# Altium schematic sheet Schematics.SchDoc
size A4
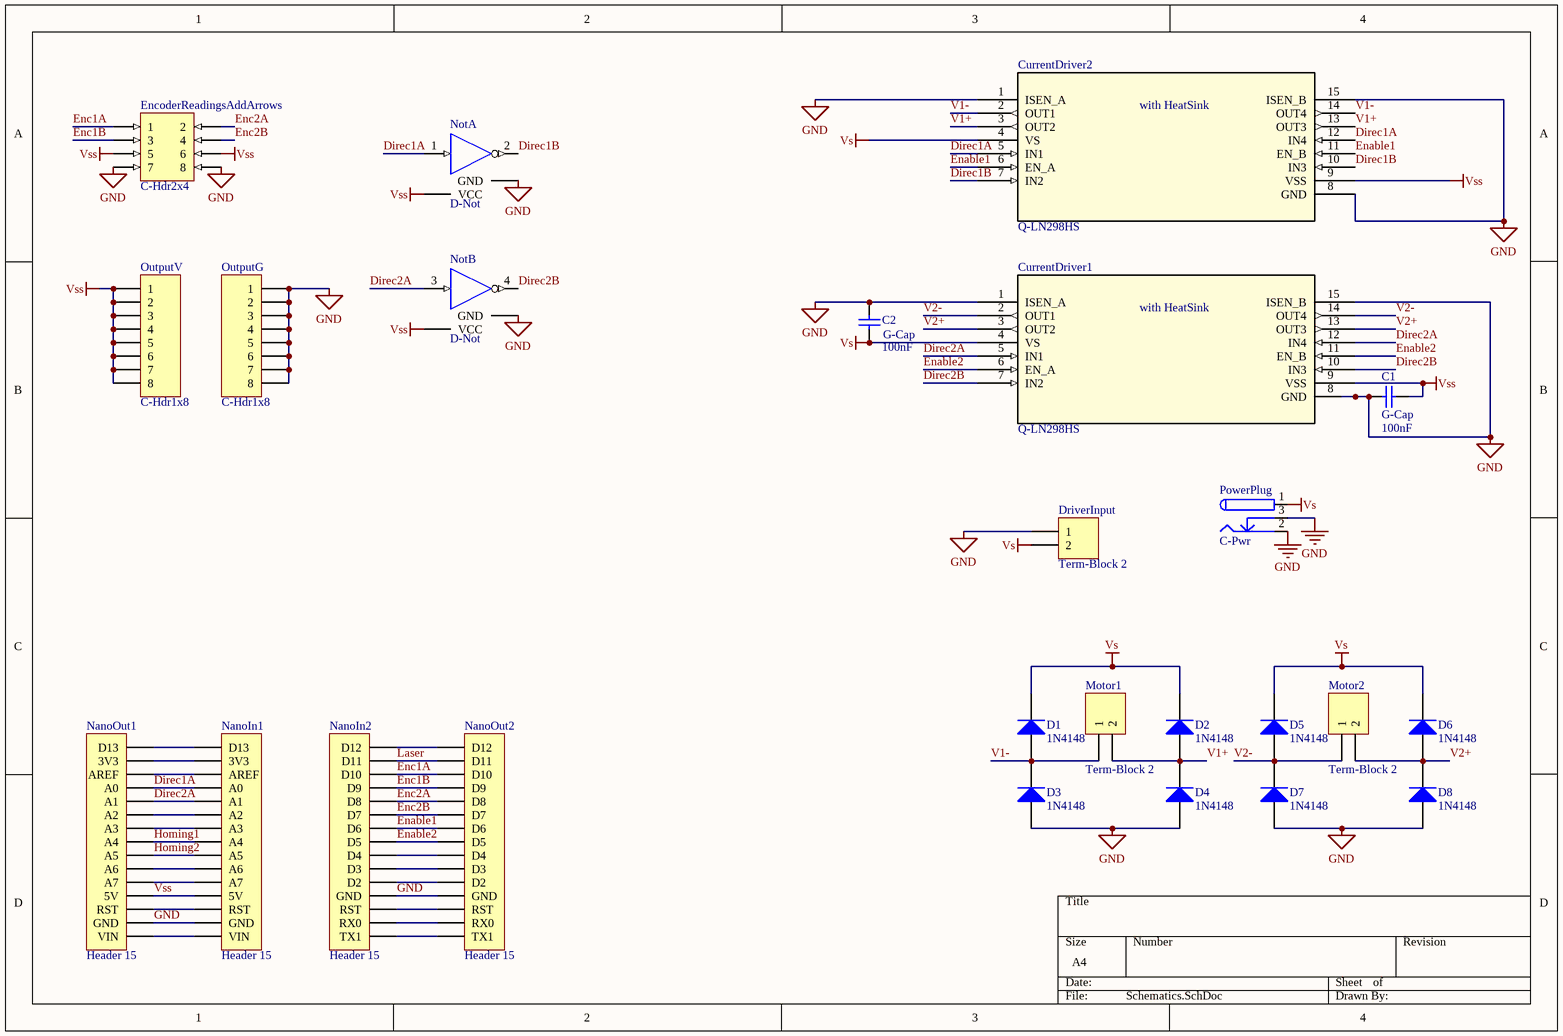
[diagram p0: Schematics.SchDoc]

## Parts
C1  G-Cap  value 100nF  [Cap2.54mm_LGE1.0]
C2  G-Cap  value 100nF  [Cap2.54mm_LGE1.0]
CurrentDriver1  Q-LN298HS  [Multiwatt15_V_ELEC391HS]
CurrentDriver2  Q-LN298HS  [Multiwatt15_V_ELEC391HS]
D1  1N4148  [DO-41_XLGE1.2]
D2  1N4148  [DO-41_XLGE1.2]
D3  1N4148  [DO-41_XLGE1.2]
D4  1N4148  [DO-41_XLGE1.2]
D5  1N4148  [DO-41_XLGE1.2]
D6  1N4148  [DO-41_XLGE1.2]
D7  1N4148  [DO-41_XLGE1.2]
D8  1N4148  [DO-41_XLGE1.2]
DriverInput  Term-Block 2  [TERM-BLOCK-5.08MM-2POS]
EncoderReadingsAddArrows  C-Hdr2x4  [HDR2X4_LGE1.0]
Motor1  Term-Block 2  [TERM-BLOCK-5.08MM-2POS]
Motor2  Term-Block 2  [TERM-BLOCK-5.08MM-2POS]
NanoIn1  Header 15  [HDR1X15]
NanoIn2  Header 15  [HDR1X15]
NanoOut1  Header 15  [HDR1X15]
NanoOut2  Header 15  [HDR1X15]
Not  D-Not  [DIP14_LGE1.0]  (parts A,B of 6)
OutputG  C-Hdr1x8  [HDR1X8_LGE1.0]
OutputV  C-Hdr1x8  [HDR1X8_LGE1.0]
PowerPlug  C-Pwr  [KLD_XLGE1.2]

## Nets
GND: C1.1 C2.2 CurrentDriver1.1(ISEN_A) CurrentDriver1.8(GND) CurrentDriver1.15(ISEN_B) CurrentDriver2.1(ISEN_A) CurrentDriver2.8(GND) CurrentDriver2.15(ISEN_B) D3.1(A) D4.1(A) D7.1(A) D8.1(A) DriverInput.1 EncoderReadingsAddArrows.7 EncoderReadingsAddArrows.8 NanoIn1.14(GND) NanoIn2.12(GND) NanoOut1.14(GND) NanoOut2.12(GND) Not.7(GND) OutputG.1 OutputG.2 OutputG.3 OutputG.4 OutputG.5 OutputG.6 OutputG.7 OutputG.8 PowerPlug.2 PowerPlug.3
Vs: C2.1 CurrentDriver1.4(VS) CurrentDriver2.4(VS) D1.2(K) D2.2(K) D5.2(K) D6.2(K) DriverInput.2 PowerPlug.1
Vss: C1.2 CurrentDriver1.9(VSS) CurrentDriver2.9(VSS) EncoderReadingsAddArrows.5 EncoderReadingsAddArrows.6 NanoIn1.12(5V) NanoOut1.12(5V) Not.14(VCC) OutputV.1 OutputV.2 OutputV.3 OutputV.4 OutputV.5 OutputV.6 OutputV.7 OutputV.8
Direc1A: CurrentDriver2.5(IN1) CurrentDriver2.12(IN4) NanoIn1.4(A0) NanoOut1.4(A0) Not.1(A)
Direc1B: CurrentDriver2.7(IN2) CurrentDriver2.10(IN3) Not.2(Y)
Direc2A: CurrentDriver1.5(IN1) CurrentDriver1.12(IN4) NanoIn1.5(A1) NanoOut1.5(A1) Not.3(A)
Direc2B: CurrentDriver1.7(IN2) CurrentDriver1.10(IN3) Not.4(Y)
Enable1: CurrentDriver2.6(EN_A) CurrentDriver2.11(EN_B) NanoIn2.7(D6) NanoOut2.7(D6)
Enable2: CurrentDriver1.6(EN_A) CurrentDriver1.11(EN_B) NanoIn2.8(D5) NanoOut2.8(D5)
Enc1A: EncoderReadingsAddArrows.1 NanoIn2.3(D10) NanoOut2.3(D10)
Enc1B: EncoderReadingsAddArrows.3 NanoIn2.4(D9) NanoOut2.4(D9)
Enc2A: EncoderReadingsAddArrows.2 NanoIn2.5(D8) NanoOut2.5(D8)
Enc2B: EncoderReadingsAddArrows.4 NanoIn2.6(D7) NanoOut2.6(D7)
Homing1: NanoIn1.8(A4) NanoOut1.8(A4)
Homing2: NanoIn1.9(A5) NanoOut1.9(A5)
Laser: NanoIn2.2(D11) NanoOut2.2(D11)
V1+: CurrentDriver2.3(OUT2) CurrentDriver2.13(OUT3) D2.1(A) D4.2(K) Motor1.2
V1-: CurrentDriver2.2(OUT1) CurrentDriver2.14(OUT4) D1.1(A) D3.2(K) Motor1.1
V2+: CurrentDriver1.3(OUT2) CurrentDriver1.13(OUT3) D6.1(A) D8.2(K) Motor2.2
V2-: CurrentDriver1.2(OUT1) CurrentDriver1.14(OUT4) D5.1(A) D7.2(K) Motor2.1
NetNanoIn1_1: NanoIn1.1(D13) NanoOut1.1(D13)
NetNanoIn1_2: NanoIn1.2(3V3) NanoOut1.2(3V3)
NetNanoIn1_3: NanoIn1.3(AREF) NanoOut1.3(AREF)
NetNanoIn1_6: NanoIn1.6(A2) NanoOut1.6(A2)
NetNanoIn1_7: NanoIn1.7(A3) NanoOut1.7(A3)
NetNanoIn1_10: NanoIn1.10(A6) NanoOut1.10(A6)
NetNanoIn1_11: NanoIn1.11(A7) NanoOut1.11(A7)
NetNanoIn1_13: NanoIn1.13(RST) NanoOut1.13(RST)
NetNanoIn1_15: NanoIn1.15(VIN) NanoOut1.15(VIN)
NetNanoIn2_1: NanoIn2.1(D12) NanoOut2.1(D12)
NetNanoIn2_9: NanoIn2.9(D4) NanoOut2.9(D4)
NetNanoIn2_10: NanoIn2.10(D3) NanoOut2.10(D3)
NetNanoIn2_11: NanoIn2.11(D2) NanoOut2.11(D2)
NetNanoIn2_13: NanoIn2.13(RST) NanoOut2.13(RST)
NetNanoIn2_14: NanoIn2.14(RX0) NanoOut2.14(RX0)
NetNanoIn2_15: NanoIn2.15(TX1) NanoOut2.15(TX1)

## Notes on the sheet
- (in symbol Q-LN298HS) with HeatSink

## Library data of the parts
C1 C2 = G-Cap: Capacitor (specify value); Published: 8-Jun-2000; LatestRevisionDate: 17-Jul-2002; LatestRevisionNote: Re-released for DXP Platform.; PackageReference: RAD-0.3; Publisher: Altium Limited
CurrentDriver1 CurrentDriver2 = Q-LN298HS: LN298 - IC Bridge Driver Par 15Multiwatt; Manufacturer_Part_Number: L298N; Vendor: ST Microelectronics; Input Type: Non-Inverting; Number of Outputs: 4; Current - Output / Channel: 2A; Current - Peak Output: 3A; Voltage - Supply: 4.5 V ~ 46 V; C: Copyright (C) 2015 Accelerated Designs. All rights reserved; Quantity_Available: 5651; DataSheet: http://www.st.com/internet/com/TECHNICAL_RESOURCES/TECHNICAL_LITERATURE/DATASHEET/CD00000240.pdf; Type: Type; On-State Resistance: -; Operating Temperature: -25Â°C ~ 130Â°C; Mounting Type: Through Hole; Package / Case: Multiwatt-15 (Vertical, Bent and Staggered Leads); Supplier Device Package: 15-Multiwatt; Packaging: Tube; Copyright: Copyright (C) 2015 Accelerated Designs. All rights reserved; RefDes: RefDes; Value: Value; ComponentLink1URL: http://www.st.com/content/ccc/resource/technical/document/datasheet/82/cc/3f/39/0a/29/4d/f0/CD00000240.pdf/files/CD00000240.pdf/jcr:content/translations/en.CD00000240.pdf; ComponentLink1Description: Datasheet (ELEC391)
D1-D8 = T-DiodeRect: High-speed Diode; ComponentLink1URL: http://www.mccsemi.com/up_pdf/1N4148(DO-35).pdf; ComponentLink1Description: Datasheet (ELEC391)
DriverInput Motor1 Motor2 = C-Block2: Terminal-Block 1x2; LatestRevisionDate: 17-Jul-2002; LatestRevisionNote: Re-released for DXP Platform.; Publisher: Altium Limited
EncoderReadingsAddArrows = C-Hdr2x4: Header, 4-Pin, Dual row; LatestRevisionDate: 17-Jul-2002; LatestRevisionNote: Re-released for DXP Platform.; Publisher: Altium Limited
NanoIn1 NanoIn2 NanoOut1 NanoOut2 = Header 15: Header, 15-Pin; LatestRevisionDate: 17-Jul-2002; LatestRevisionNote: Re-released for DXP Platform.; Publisher: Altium Limited
Not = D-Not: Hex NOT gate (inverter); Published: 8-Jun-2000; LatestRevisionDate: 04-Mar-2005; LatestRevisionNote: Stylized 3D Model Added.; DatasheetVersion: Mar-1988; PackageVersion: Oct-1995; PackageReference: N014; Publisher: Altium Limited; PackageDescription: DIP; 14 Leads; Row Spacing 7.62 mm; Pitch 2.54 mm; ComponentLink1Description: Manufacturer Link; ComponentLink1URL: http://www.ti.com/; ComponentLink2Description: Datasheet; ComponentLink2URL: http://www-s.ti.com/sc/ds/sn74ls04.pdf; ComponentLink3URL: http://media.digikey.com/pdf/Data%20Sheets/ST%20Microelectronics%20PDFS/M74HCT04.pdf; ComponentLink3Description: Datasheet (ELEC391)
OutputG OutputV = C-Hdr1x8: Header, 8-Pin; LatestRevisionDate: 17-Jul-2002; LatestRevisionNote: Re-released for DXP Platform.; Publisher: Altium Limited
PowerPlug = C-Pwr: Low Voltage Power Supply Connector; Published: 17-Dec-2003; DatasheetDocument: 09-May-2002; Publisher: Altium Limited; ComponentLink1Description: Manufacturer Link; ComponentLink1URL: http://domino.kycon.com/internet/Products.html; ComponentLink2URL: http://www.cui.com/product/resource/pj-102a.pdf; ComponentLink2Description: Datasheet (ELEC391)